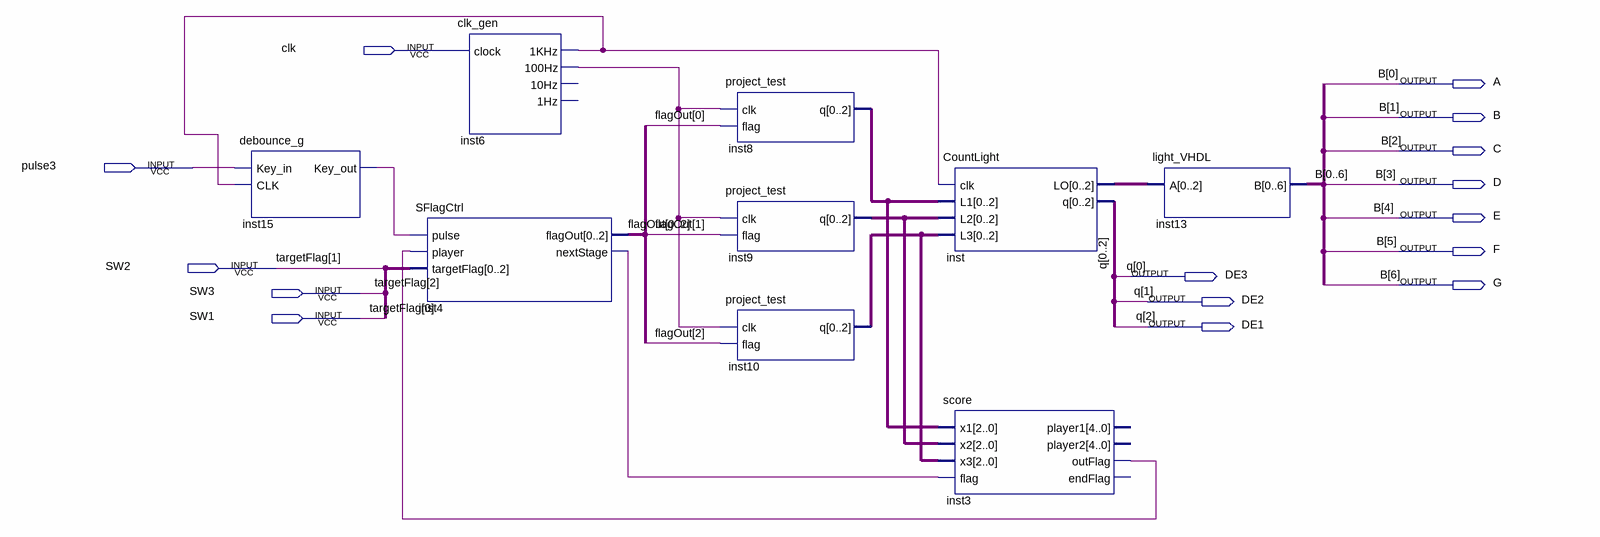
[diagram p0: schematic sheet]
// Quartus schematic test.bdf as structural Verilog: 9 symbols, 15 pins
module test (
  input  clk,
  input  pulse3,
  input  SW2,
  input  SW3,
  input  SW1,
  output A,
  output B,
  output C,
  output D,
  output E,
  output F,
  output DE3,
  output G,
  output DE2,
  output DE1
);

  wire inst3_outflag, inst4_nextstage, inst6_1khz, inst6_100hz, inst15_key_out;
  wire [2:0] flagOut, inst8_q, inst9_q, inst10_q, inst_lo, undriven;

  debounce_g inst15 (.Key_in(pulse3), .CLK(inst6_1khz), .Key_out(inst15_key_out));
  SFlagCtrl inst4 (
    .pulse(inst15_key_out), .player(inst3_outflag), .targetFlag(undriven),
    .flagOut({flagOut[0], flagOut[1], flagOut[2]}), .nextStage(inst4_nextstage));
  clk_gen inst6 (.clock(clk), .\1KHz (inst6_1khz), .\100Hz (inst6_100hz));  // open: 10Hz, 1Hz
  project_test inst8 (.clk(inst6_100hz), .flag(flagOut[0]), .q(inst8_q));
  project_test inst9 (.clk(inst6_100hz), .flag(flagOut[1]), .q(inst9_q));
  project_test inst10 (.clk(inst6_100hz), .flag(flagOut[2]), .q(inst10_q));
  CountLight inst (.clk(inst6_1khz), .L1(inst8_q), .L2(inst9_q), .L3(inst10_q), .LO(inst_lo), .q({DE3, DE2, DE1}));
  score inst3 (
    .x1(inst8_q), .x2(inst9_q), .x3(inst10_q), .flag(inst4_nextstage), .outFlag(inst3_outflag));  // open: player1, player2, endFlag
  light_VHDL inst13 (.A(inst_lo), .B({A, B, C, D, E, F, G}));

  // Other names for the same wires on the sheet: B[6:0] = {G, F, E, D, C, B, A}; q[2:0] = {DE1, DE2, DE3};
  //   targetFlag[2:0] = {SW3, SW2, SW1}
endmodule
